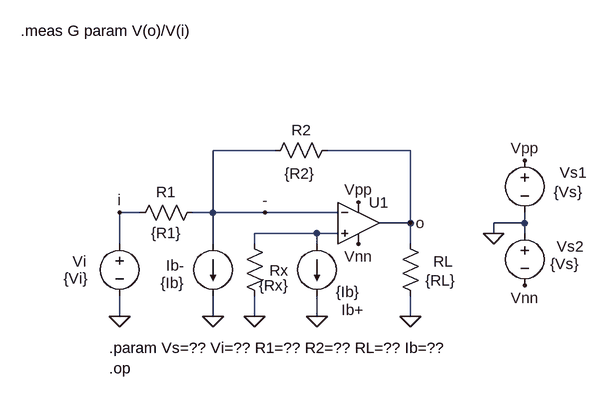
[diagram p0: schematic nideal05opFig.asc]
nideal05opFig.asc, the LTspice schematic file:
Version 4
SHEET 1 968 680
WIRE 112 112 16 112
WIRE 320 112 192 112
WIRE -96 208 -128 208
WIRE 16 208 16 112
WIRE 16 208 -16 208
WIRE 96 208 16 208
WIRE 208 208 96 208
WIRE 320 224 320 112
WIRE 320 224 272 224
WIRE 496 224 496 208
WIRE 496 224 448 224
WIRE 176 240 80 240
WIRE 208 240 176 240
WIRE 448 240 448 224
WIRE 496 240 496 224
WIRE -128 256 -128 208
WIRE 16 256 16 208
WIRE 80 256 80 240
WIRE 176 256 176 240
WIRE 320 256 320 224
WIRE -128 368 -128 336
WIRE 16 368 16 336
WIRE 80 368 80 336
WIRE 176 368 176 336
WIRE 320 368 320 336
FLAG 496 128 Vpp
FLAG 448 240 0
FLAG 496 320 Vnn
FLAG 320 368 0
FLAG -128 368 0
FLAG 240 192 Vpp
FLAG 240 256 Vnn
FLAG 80 368 0
FLAG 320 224 o
FLAG -128 208 i
FLAG 96 208 -
FLAG 16 368 0
FLAG 176 368 0
SYMBOL voltage 496 112 R0
WINDOW 123 0 0 Left 0
WINDOW 39 0 0 Left 0
WINDOW 0 54 34 Left 2
WINDOW 3 45 64 Left 2
SYMATTR InstName Vs1
SYMATTR Value {Vs}
SYMBOL voltage 496 224 R0
WINDOW 123 0 0 Left 0
WINDOW 39 0 0 Left 0
WINDOW 0 49 36 Left 2
WINDOW 3 39 63 Left 2
SYMATTR InstName Vs2
SYMATTR Value {Vs}
SYMBOL res 304 240 R0
WINDOW 0 51 43 Left 2
WINDOW 3 39 72 Left 2
SYMATTR InstName RL
SYMATTR Value {RL}
SYMBOL voltage -128 240 R0
WINDOW 3 -86 69 Left 2
WINDOW 123 0 0 Left 0
WINDOW 39 0 0 Left 0
WINDOW 0 -72 43 Left 2
SYMATTR Value {Vi}
SYMATTR InstName Vi
SYMBOL Opamps\\UniversalOpamp2 240 224 R0
SYMATTR InstName U1
SYMBOL res 0 192 R90
WINDOW 0 0 56 VBottom 2
WINDOW 3 32 56 VTop 2
SYMATTR InstName R1
SYMATTR Value {R1}
SYMBOL res 208 96 R90
WINDOW 0 0 56 VBottom 2
WINDOW 3 36 58 VTop 2
SYMATTR InstName R2
SYMATTR Value {R2}
SYMBOL current 16 256 R0
WINDOW 0 -72 33 Left 2
WINDOW 3 -81 60 Left 2
WINDOW 123 0 0 Left 0
WINDOW 39 0 0 Left 0
SYMATTR InstName Ib-
SYMATTR Value {Ib}
SYMBOL res 64 240 R0
WINDOW 0 39 57 Left 2
WINDOW 3 23 80 Left 2
SYMATTR InstName Rx
SYMATTR Value {Rx}
SYMBOL current 176 256 R0
WINDOW 0 38 102 Left 2
WINDOW 3 29 74 Left 2
WINDOW 123 0 0 Left 0
WINDOW 39 0 0 Left 0
SYMATTR InstName Ib+
SYMATTR Value {Ib}
TEXT -144 416 Left 2 !.param Vs=?? Vi=?? R1=?? R2=?? RL=?? Ib=??
TEXT -144 448 Left 2 !.op
TEXT -280 -72 Left 2 !.meas G param V(o)/V(i)

The netlist it stands for:
* nideal05opFig.asc
Vs1 Vpp 0 {Vs}
Vs2 0 Vnn {Vs}
RL o 0 {RL}
Vi i 0 {Vi}
XU1 N001 - Vpp Vnn o level.2 Avol=1Meg GBW=10Meg Slew=10Meg ilimit=25m rail=0 Vos=0 phimargin=45 en=0 enk=0 in=0 ink=0 Rin=500Meg  ; pins IN+ IN- V+ V- OUT
R1 - i {R1}
R2 o - {R2}
Ib- - 0 {Ib}
Rx N001 0 {Rx}
Ib+ N001 0 {Ib}
.param Vs=?? Vi=?? R1=?? R2=?? RL=?? Ib=??
.op
.meas G param V(o)/V(i)
.lib UniversalOpamps2.sub
.backanno
.end